# Altium schematic sheet Top.SchDoc: TOP
size A3; Author: P.A.; CompanyName: STMicroelectronics; Organization: Microcontrollers Division; Address1: 12, Rue Jules HOROWITZ; Address2: 38019 Grenoble; Address3: FRANCE; DocumentNumber: MB1261; Revision: B.01; SheetNumber: 2; SheetTotal: 15; Project: STM32L496G-DISCO
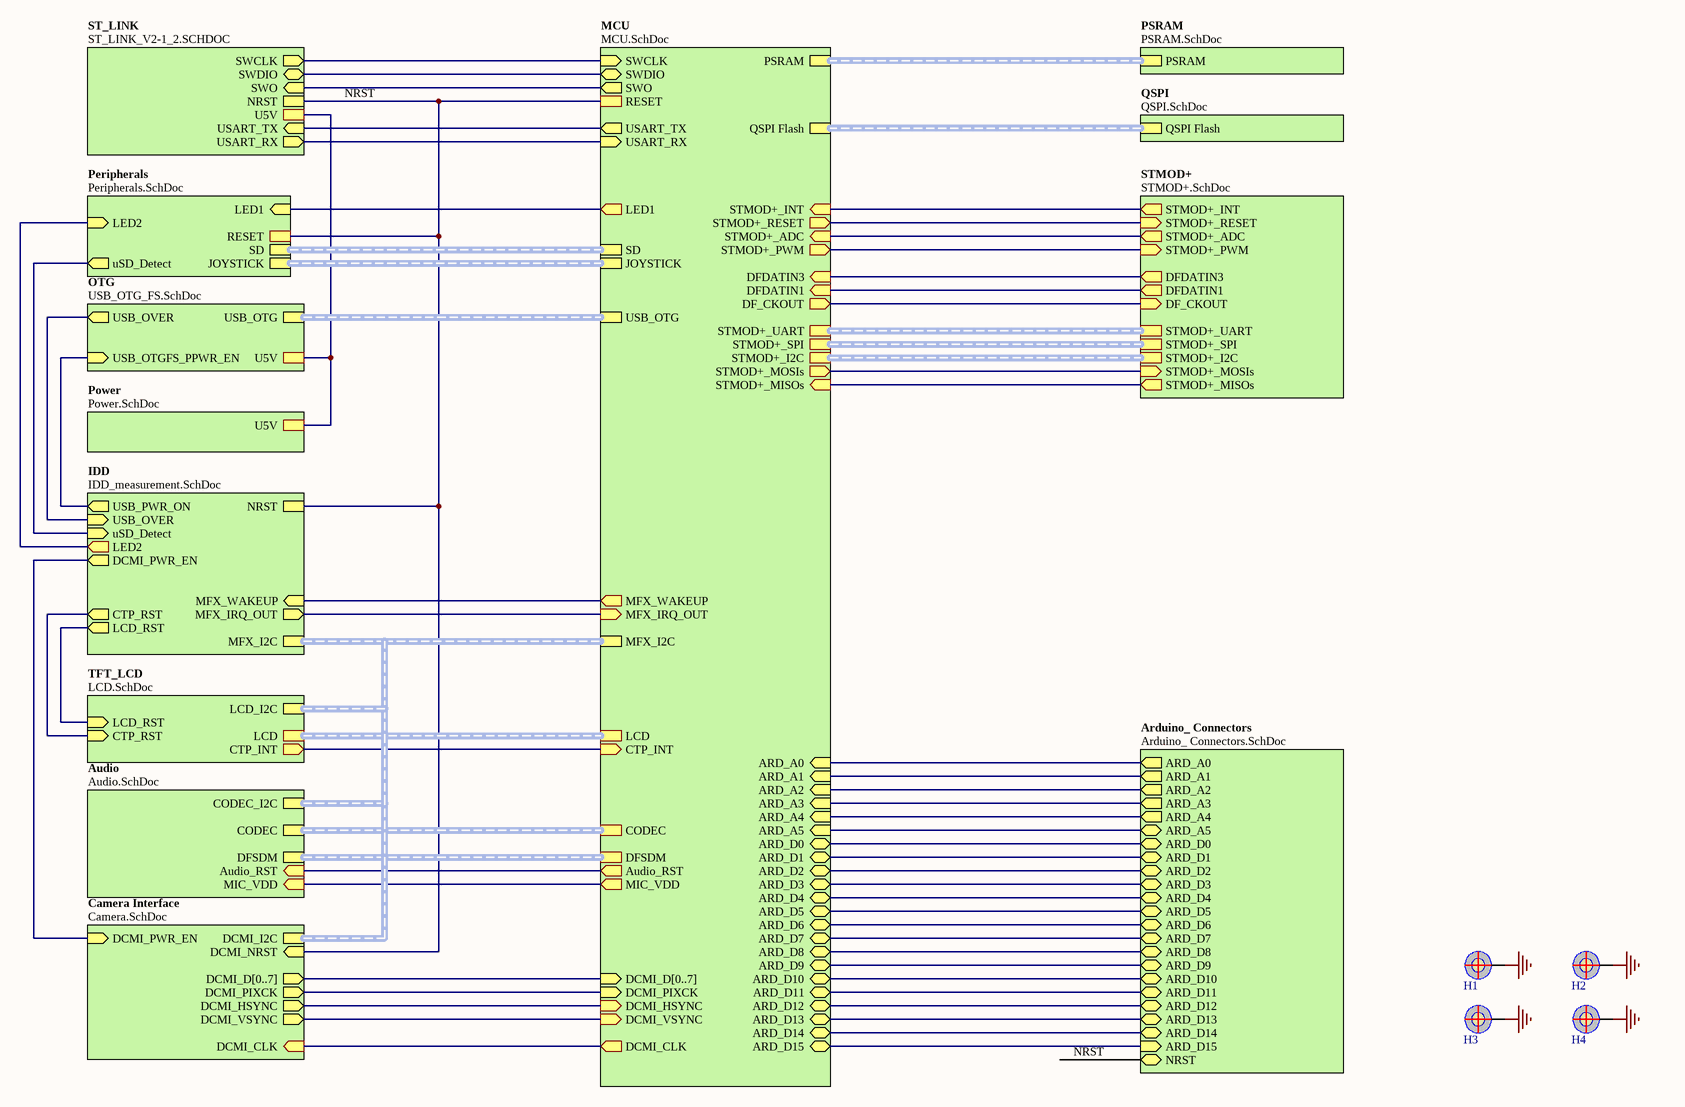
[diagram p0: Top.SchDoc]

## Parts
H1  POSITION HOLE  [Hole_C7d3r5]  (value not drawn)
H2  POSITION HOLE  [Hole_C7d3r5]  (value not drawn)
H3  POSITION HOLE  [Hole_C7d3r5]  (value not drawn)
H4  POSITION HOLE  [Hole_C7d3r5]  (value not drawn)

## Sub-sheets
Arduino_ Connectors = Arduino_ Connectors.SchDoc: NRST (bidir), ARD_A0 (out), ARD_A1 (out), ARD_A2 (out), ARD_A3 (out), ARD_A4 (out), ARD_A5 (bidir), ARD_D5 (bidir), ARD_D4 (bidir), ARD_D3 (bidir), ARD_D2 (bidir), ARD_D1 (bidir), ARD_D0 (bidir), ARD_D13 (bidir), ARD_D12 (bidir), ARD_D11 (bidir), ARD_D10 (bidir), ARD_D9 (bidir), ARD_D8 (bidir), ARD_D6 (bidir), ARD_D7 (bidir), ARD_D15 (in), ARD_D14 (bidir)
Audio = Audio.SchDoc: CODEC (harness SAI), CODEC_I2C (harness I2C), DFSDM (harness DFSDM), MIC_VDD (in), Audio_RST (in)
Camera Interface = Camera.SchDoc: DCMI_D[0..7] (out), DCMI_NRST (in), DCMI_PWR_EN (in), DCMI_VSYNC (out), DCMI_HSYNC (out), DCMI_PIXCK (out), DCMI_I2C (harness I2C), DCMI_CLK (in)
IDD = IDD_measurement.SchDoc: MFX_IRQ_OUT (out), MFX_WAKEUP (in), NRST, MFX_I2C (harness I2C), USB_PWR_ON (out), DCMI_PWR_EN (out), uSD_Detect (in), USB_OVER (in), CTP_RST (out), LCD_RST (out), LED2 (out)
MCU = MCU.SchDoc: QSPI Flash (harness QSPI), PSRAM (harness PSRAM), SD (harness SD), JOYSTICK (harness JOYSTICK), USB_OTG (harness USB_OTG), MFX_IRQ_OUT (in), MFX_WAKEUP (out), ARD_A0 (in), MFX_I2C (harness I2C), ARD_A1 (in), ARD_A2 (in), ARD_A3 (in), ARD_A4 (in), ARD_A5 (in), ARD_D0 (bidir), ARD_D1 (bidir), ARD_D2 (bidir), ARD_D3 (bidir), ARD_D4 (bidir), ARD_D5 (bidir), ARD_D6 (bidir), ARD_D7 (bidir), ARD_D8 (bidir), ARD_D9 (bidir), ARD_D10 (bidir), ARD_D11 (bidir), ARD_D12 (bidir), ARD_D13 (bidir), ARD_D14 (bidir), ARD_D15 (bidir), USART_TX (out), USART_RX (in), SWCLK (in), SWDIO (bidir), SWO (out), DCMI_D[0..7] (in), DCMI_VSYNC (in), DCMI_HSYNC (in), DCMI_PIXCK (in), STMOD+_UART (harness UART), STMOD+_I2C (harness I2C), STMOD+_INT (in), STMOD+_RESET (out), STMOD+_ADC (in), STMOD+_PWM (out), STMOD+_MOSIs (out), STMOD+_MISOs (in), STMOD+_SPI (harness SPI), DFDATIN3 (in), DFDATIN1 (in), DFSDM (harness DFSDM), MIC_VDD (out), CODEC (harness SAI), LED1 (out), RESET, DCMI_CLK (out), LCD (harness LCD), CTP_INT (in), DF_CKOUT (out), Audio_RST (out)
OTG = USB_OTG_FS.SchDoc: USB_OTG (harness USB_OTG), USB_OTGFS_PPWR_EN (in), USB_OVER (out), U5V
Peripherals = Peripherals.SchDoc: LED1 (in), SD (harness SD), JOYSTICK (harness JOYSTICK), LED2 (in), uSD_Detect (out), RESET
Power = Power.SchDoc: U5V
PSRAM = PSRAM.SchDoc: PSRAM (harness PSRAM)
QSPI = QSPI.SchDoc: QSPI Flash (harness QSPI)
ST_LINK = ST_LINK_V2-1_2.SCHDOC: NRST, SWCLK (out), SWDIO (bidir), SWO (in), USART_TX (in), USART_RX (out), U5V
STMOD+ = STMOD+.SchDoc: STMOD+_INT (out), STMOD+_RESET (in), STMOD+_ADC (out), DFDATIN3 (out), STMOD+_PWM (in), DFDATIN1 (out), STMOD+_UART (harness UART), STMOD+_SPI (harness SPI), STMOD+_I2C (harness I2C), STMOD+_MOSIs (in), STMOD+_MISOs (out), DF_CKOUT (in)
TFT_LCD = LCD.SchDoc: LCD_I2C (harness I2C), CTP_RST (in), LCD_RST (in), LCD (harness LCD), CTP_INT (out)

## Nets
GND: H1.1 H2.1 H3.1 H4.1
NRST: sheet Arduino_ Connectors/NRST, sheet Camera Interface/DCMI_NRST, sheet IDD/NRST, sheet MCU/RESET, sheet Peripherals/RESET, sheet ST_LINK/NRST
(unnamed): sheet Arduino_ Connectors/ARD_A0, sheet MCU/ARD_A0
(unnamed): sheet Arduino_ Connectors/ARD_A1, sheet MCU/ARD_A1
(unnamed): sheet Arduino_ Connectors/ARD_A2, sheet MCU/ARD_A2
(unnamed): sheet Arduino_ Connectors/ARD_A3, sheet MCU/ARD_A3
(unnamed): sheet Arduino_ Connectors/ARD_A4, sheet MCU/ARD_A4
(unnamed): sheet Arduino_ Connectors/ARD_A5, sheet MCU/ARD_A5
(unnamed): sheet Arduino_ Connectors/ARD_D5, sheet MCU/ARD_D5
(unnamed): sheet Arduino_ Connectors/ARD_D4, sheet MCU/ARD_D4
(unnamed): sheet Arduino_ Connectors/ARD_D3, sheet MCU/ARD_D3
(unnamed): sheet Arduino_ Connectors/ARD_D2, sheet MCU/ARD_D2
(unnamed): sheet Arduino_ Connectors/ARD_D1, sheet MCU/ARD_D1
(unnamed): sheet Arduino_ Connectors/ARD_D0, sheet MCU/ARD_D0
(unnamed): sheet Arduino_ Connectors/ARD_D13, sheet MCU/ARD_D13
(unnamed): sheet Arduino_ Connectors/ARD_D12, sheet MCU/ARD_D12
(unnamed): sheet Arduino_ Connectors/ARD_D11, sheet MCU/ARD_D11
(unnamed): sheet Arduino_ Connectors/ARD_D10, sheet MCU/ARD_D10
(unnamed): sheet Arduino_ Connectors/ARD_D9, sheet MCU/ARD_D9
(unnamed): sheet Arduino_ Connectors/ARD_D8, sheet MCU/ARD_D8
(unnamed): sheet Arduino_ Connectors/ARD_D6, sheet MCU/ARD_D6
(unnamed): sheet Arduino_ Connectors/ARD_D7, sheet MCU/ARD_D7
(unnamed): sheet Arduino_ Connectors/ARD_D15, sheet MCU/ARD_D15
(unnamed): sheet Arduino_ Connectors/ARD_D14, sheet MCU/ARD_D14
(unnamed): sheet Camera Interface/DCMI_PWR_EN, sheet IDD/DCMI_PWR_EN
(unnamed): sheet Camera Interface/DCMI_VSYNC, sheet MCU/DCMI_VSYNC
(unnamed): sheet Camera Interface/DCMI_HSYNC, sheet MCU/DCMI_HSYNC
(unnamed): sheet Camera Interface/DCMI_PIXCK, sheet MCU/DCMI_PIXCK
(unnamed): sheet Camera Interface/DCMI_CLK, sheet MCU/DCMI_CLK
(unnamed): sheet IDD/MFX_IRQ_OUT, sheet MCU/MFX_IRQ_OUT
(unnamed): sheet IDD/MFX_WAKEUP, sheet MCU/MFX_WAKEUP
(unnamed): sheet IDD/USB_PWR_ON, sheet OTG/USB_OTGFS_PPWR_EN
(unnamed): sheet IDD/uSD_Detect, sheet Peripherals/uSD_Detect
(unnamed): sheet IDD/USB_OVER, sheet OTG/USB_OVER
(unnamed): sheet IDD/CTP_RST, sheet TFT_LCD/CTP_RST
(unnamed): sheet IDD/LCD_RST, sheet TFT_LCD/LCD_RST
(unnamed): sheet IDD/LED2, sheet Peripherals/LED2
(unnamed): sheet TFT_LCD/CTP_INT, sheet MCU/CTP_INT
(unnamed): sheet MCU/USART_TX, sheet ST_LINK/USART_TX
(unnamed): sheet MCU/USART_RX, sheet ST_LINK/USART_RX
(unnamed): sheet MCU/SWCLK, sheet ST_LINK/SWCLK
(unnamed): sheet MCU/SWDIO, sheet ST_LINK/SWDIO
(unnamed): sheet MCU/SWO, sheet ST_LINK/SWO
(unnamed): sheet MCU/STMOD+_INT, sheet STMOD+/STMOD+_INT
(unnamed): sheet MCU/STMOD+_RESET, sheet STMOD+/STMOD+_RESET
(unnamed): sheet MCU/STMOD+_ADC, sheet STMOD+/STMOD+_ADC
(unnamed): sheet MCU/STMOD+_PWM, sheet STMOD+/STMOD+_PWM
(unnamed): sheet MCU/STMOD+_MOSIs, sheet STMOD+/STMOD+_MOSIs
(unnamed): sheet MCU/STMOD+_MISOs, sheet STMOD+/STMOD+_MISOs
(unnamed): sheet MCU/DFDATIN3, sheet STMOD+/DFDATIN3
(unnamed): sheet MCU/DFDATIN1, sheet STMOD+/DFDATIN1
(unnamed): sheet MCU/MIC_VDD, sheet Audio/MIC_VDD
(unnamed): sheet MCU/LED1, sheet Peripherals/LED1
(unnamed): sheet MCU/DF_CKOUT, sheet STMOD+/DF_CKOUT
(unnamed): sheet MCU/Audio_RST, sheet Audio/Audio_RST
(unnamed): sheet Power/U5V, sheet ST_LINK/U5V, sheet OTG/U5V

## Buses and harness runs
bus sheet Camera Interface/DCMI_D[0..7] = sheet MCU/DCMI_D[0..7]
harness sheet Audio/CODEC = sheet MCU/CODEC
harness sheet Audio/CODEC_I2C = sheet Camera Interface/DCMI_I2C = sheet IDD/MFX_I2C = sheet MCU/MFX_I2C = sheet TFT_LCD/LCD_I2C
harness sheet Audio/DFSDM = sheet MCU/DFSDM
harness sheet MCU/JOYSTICK = sheet Peripherals/JOYSTICK
harness sheet MCU/LCD = sheet TFT_LCD/LCD
harness sheet MCU/PSRAM = sheet PSRAM/PSRAM
harness sheet MCU/QSPI Flash = sheet QSPI/QSPI Flash
harness sheet MCU/SD = sheet Peripherals/SD
harness sheet MCU/STMOD+_I2C = sheet STMOD+/STMOD+_I2C
harness sheet MCU/STMOD+_SPI = sheet STMOD+/STMOD+_SPI
harness sheet MCU/STMOD+_UART = sheet STMOD+/STMOD+_UART
harness sheet MCU/USB_OTG = sheet OTG/USB_OTG

## Notes on the sheet
- Title:
- Project:
- Size:
- Revision:
- Variant:
- A3
- -
- Date:
- Reference:
- Sheet:
- of